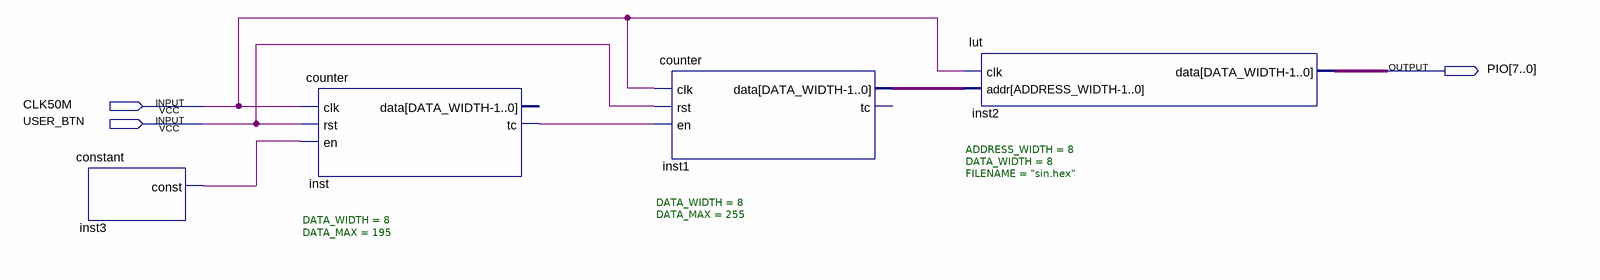
[diagram p0: schematic sheet]
// Quartus schematic R2Rsine.bdf as structural Verilog: 4 symbols, 3 pins
module R2Rsine (
  input  CLK50M,
  input  USER_BTN,
  output [7:0] PIO
);

  wire inst3_const, inst_tc;
  wire [7:0] inst1_data;

  constant inst3 (.\const (inst3_const));
  counter #(.DATA_WIDTH(8), .DATA_MAX(195)) inst (
    .clk(CLK50M), .rst(USER_BTN), .en(inst3_const), .tc(inst_tc));  // open: data
  counter #(.DATA_WIDTH(8), .DATA_MAX(255)) inst1 (
    .clk(CLK50M), .rst(USER_BTN), .en(inst_tc), .data(inst1_data));  // open: tc
  lut #(.ADDRESS_WIDTH(8), .DATA_WIDTH(8), .FILENAME("sin.hex")) inst2 (.clk(CLK50M), .addr(inst1_data), .data(PIO));
endmodule
